# EAGLE design IoT_modules_atmega328_kinemata_v1 (EAGLE 7.2.0)
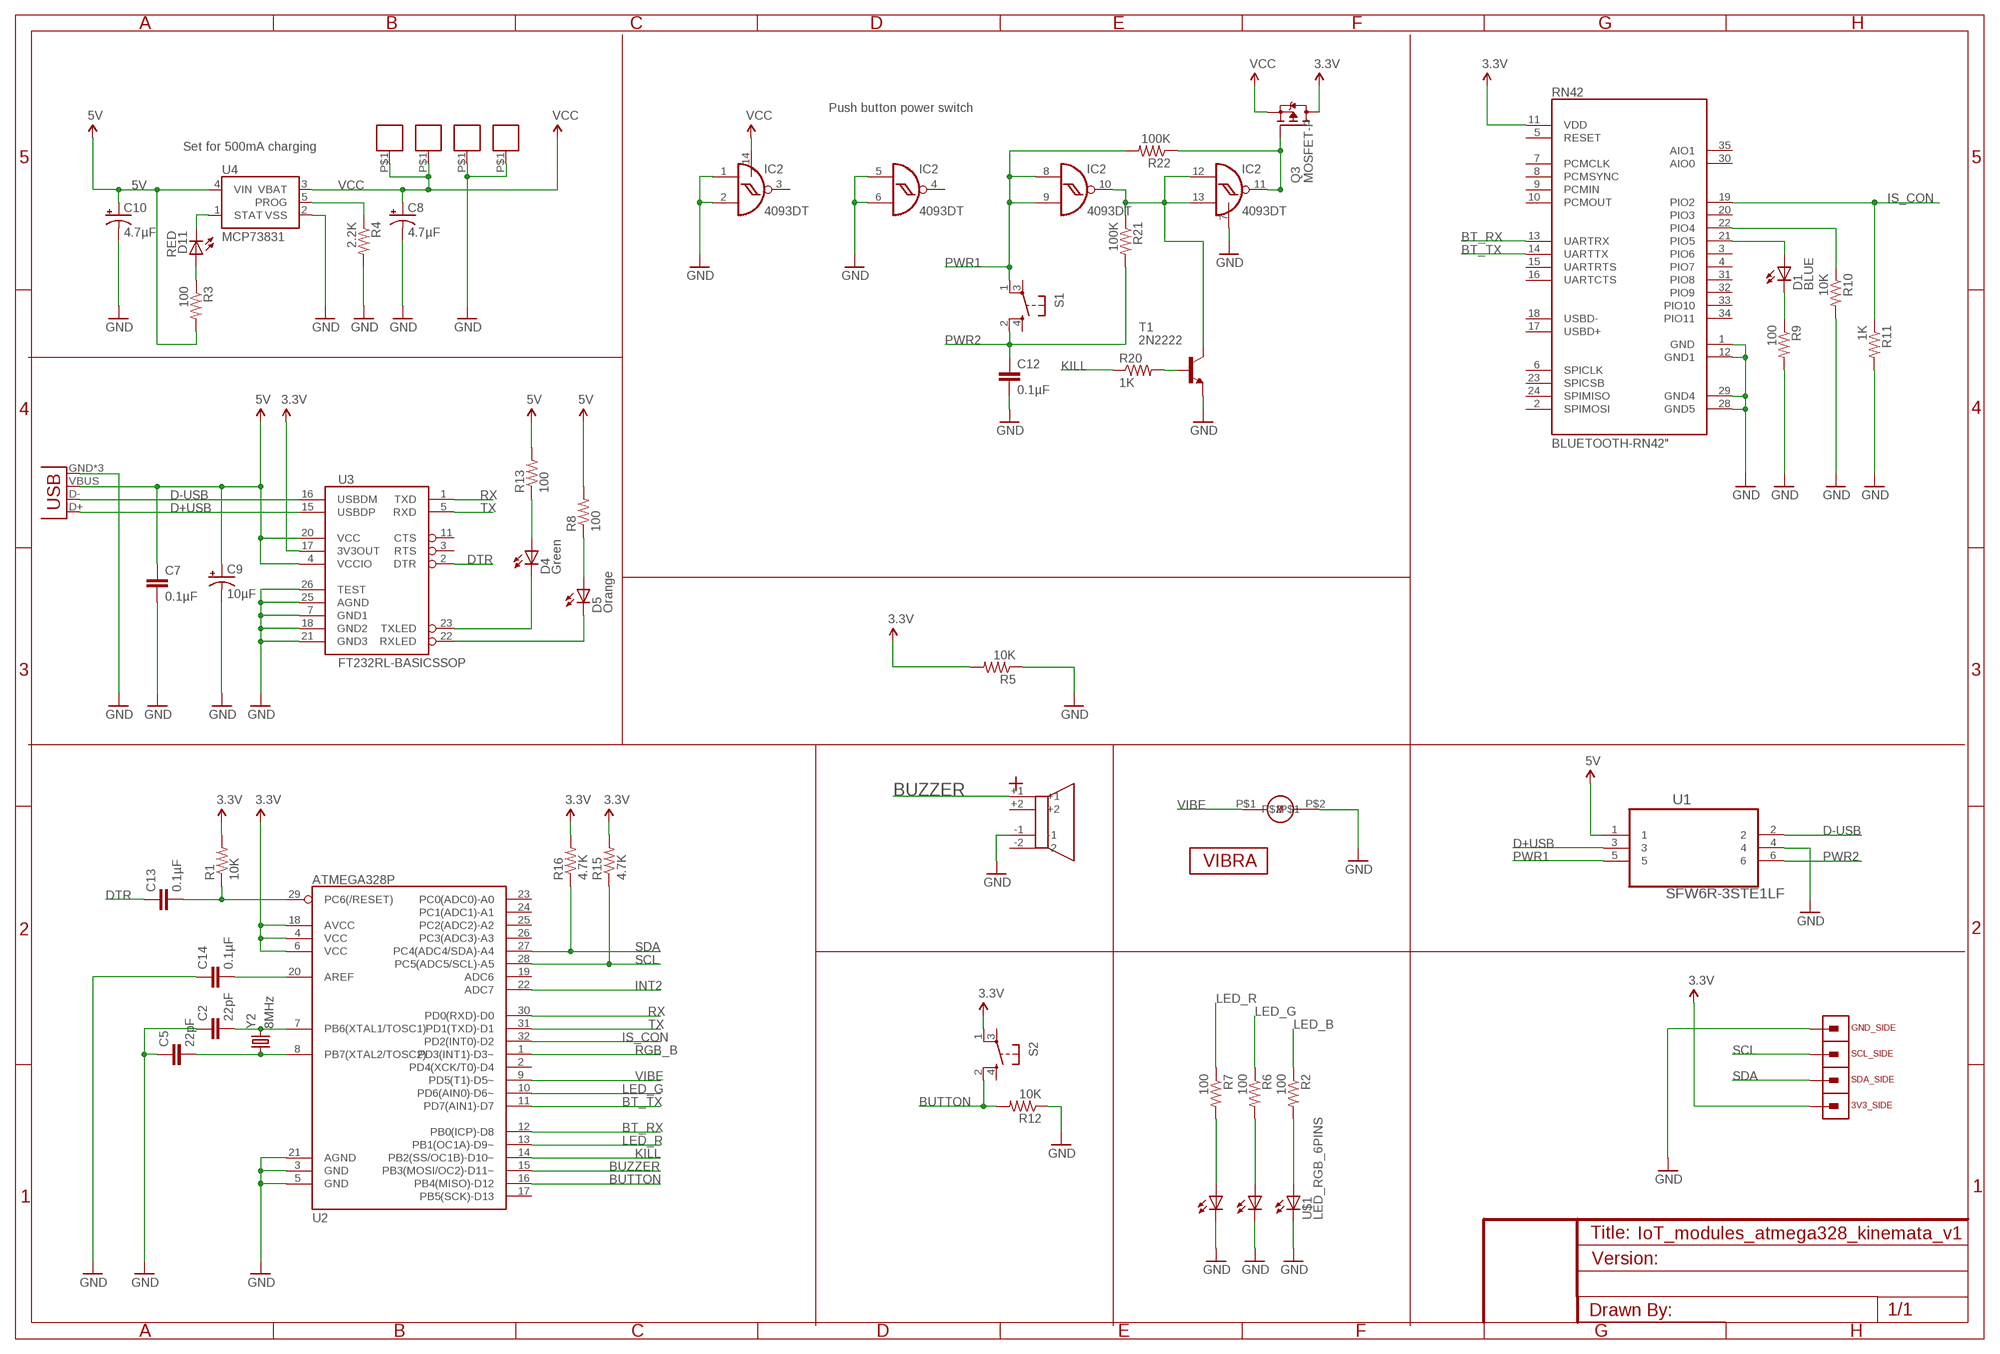
[diagram p0: schematic, sheet 1]

## Parts
3V3_SIDE  HEADER_1PIN_MALE  [SPRING_LOADED_HEADER_ANGLE_829-22-020-20-002101_DIGIKEY_ED1320-ND]
BAT+1  LIPO_PAD  [LIPO_PAD]
BAT+2  LIPO_PAD  [LIPO_PAD]
BAT-1  LIPO_PAD  [LIPO_PAD]
BAT-2  LIPO_PAD  [LIPO_PAD]
C2  22pF  CAP1206  [1206]
C5  22pF  CAP1206  [1206]
C7  0.1µF  CAP1206  [1206]
C8  4.7µF  CAP_POL1206  [EIA3216]
C9  10µF  CAP_POL1206  [EIA3216]
C10  4.7µF  CAP_POL1206  [EIA3216]
C12  0.1µF  CAP1206  [1206]
C13  0.1µF  CAP1206  [1206]
C14  0.1µF  CAP1206  [1206]
D1  BLUE  LED1206  [LED-1206]
D4  Green  LED1206  [LED-1206]
D5  Orange  LED1206  [LED-1206]
D11  RED  LED1206  [LED-1206]
GND_SIDE  HEADER_1PIN_MALE  [SPRING_LOADED_HEADER_ANGLE_829-22-020-20-002101_DIGIKEY_ED1320-ND]
IC2  4093DT  [MC14093B-TSSOP14]
JP6  USB-MICROB  [USB-MICROB]
Q3  MOSFET-P  [SOT23]
R1  10K  RESISTOR1206  [1206]
R2  100  RESISTOR1206  [1206]
R3  100  RESISTOR1206  [1206]
R4  2.2K  RESISTOR1206  [1206]
R5  10K  RESISTOR1206  [1206]
R6  100  RESISTOR1206  [1206]
R7  100  RESISTOR1206  [1206]
R8  100  RESISTOR1206  [1206]
R9  100  RESISTOR1206  [1206]
R10  10K  RESISTOR1206  [1206]
R11  1K  RESISTOR1206  [1206]
R12  10K  RESISTOR1206  [1206]
R13  100  RESISTOR1206  [1206]
R15  4.7K  RESISTOR1206  [1206]
R16  4.7K  RESISTOR1206  [1206]
R20  1K  RESISTOR1206  [1206]
R21  100K  RESISTOR1206  [1206]
R22  100K  RESISTOR1206  [1206]
RN42  BLUETOOTH-RN42"  [RN42]
S1  TAC_SWITCH_SIDEWAY  [TACTILE_SWITCH_ANGLE_SMD]
S2  TAC_SWITCH_SIDEWAY  [TACTILE_SWITCH_ANGLE_SMD]
SCL_SIDE  HEADER_1PIN_MALE  [SPRING_LOADED_HEADER_ANGLE_829-22-020-20-002101_DIGIKEY_ED1320-ND]
SDA_SIDE  HEADER_1PIN_MALE  [SPRING_LOADED_HEADER_ANGLE_829-22-020-20-002101_DIGIKEY_ED1320-ND]
T1  2N2222  [TO92-EBC-OVAL]
U1  SFW6R-3STE1LF  [FCI_SFW6R-3STE1LF]
U2  ATMEGA328P  ATMEGA328_SMT  [TQFP32-08]
U3  FT232RL-BASICSSOP  [SSOP28DB]
U4  MCP73831  [SOT23-5]
U$1  LED_RGB_6PINS  [LED_RGB_6PINS]
U$3  BUZZER_4PINS  [FARNELL_BUZZER_MAGNETIC_SMD_3V_2215091]
U$4  VIBRATION_MOTOR_SHAPE  [VIBRATION_MOTOR_SHAPE]
U$5  VIBRATION_MOTOR  [VIBRATION_MOTOR_CABLE]
Y2  8MHz  CRYSTAL_2PINS5X3.2  [CRYSTAL_8MHZ_SMD_FARNELL_2101329]

## Nets
3.3V: 3V3_SIDE.P$1 Q3.3(D) R1.2 R5.2 R15.2 R16.2 RN42.11(VDD) S2.1(A2) U2.4(VCC) U2.6(VCC) U2.18(AVCC) U3.17(3V3OUT)
5V: C7.1 C9.A(+) C10.A(+) JP6.VBUS R3.2 R8.2 R13.2 U1.1 U3.4(VCCIO) U3.20(VCC) U4.4(VIN)
BT_RX: RN42.13(UARTRX) U2.12(PB0(ICP)-D8)
BT_TX: RN42.14(UARTTX) U2.11(PD7(AIN1)-D7)
BUTTON: R12.2 S2.2(B2) U2.16(PB4(MISO)-D12)
BUZZER: U2.15(PB3(MOSI/OC2)-D11~) U$3.+1
D+USB: JP6.D+ U1.3 U3.15(USBDP)
D-USB: JP6.D- U1.2 U3.16(USBDM)
DTR: C13.1 U3.2(DTR)
GND: BAT-1.P$1 BAT-2.P$1 C2.1 C5.1 C7.2 C8.C(-) C9.C(-) C10.C(-) C12.2 C14.1 GND_SIDE.P$1 IC2.1 IC2.2 IC2.5 IC2.6 IC2.7 JP6.GND JP6.MT1(GND) JP6.MT2(GND) R4.2 R5.1 R9.2 R10.2 R11.2 R12.1 RN42.1(GND) RN42.12(GND1) RN42.28(GND5) RN42.29(GND4) T1.E U1.4 U2.3(GND) U2.5(GND) U2.21(AGND) U3.7(GND1) U3.18(GND2) U3.21(GND3) U3.25(AGND) U3.26(TEST) U4.2(VSS) U$1.BC U$1.GC U$1.RC U$3.-1 U$5.P$2
INT2: U2.22(ADC7)
IS_CON: R11.1 RN42.19(PIO2) U2.32(PD2(INT0)-D2)
KILL: R20.1 U2.14(PB2(SS/OC1B)-D10~)
LED_B: R2.1
LED_G: R6.1 U2.10(PD6(AIN0)-D6~)
LED_R: R7.1 U2.13(PB1(OC1A)-D9~)
N$1: R7.2 U$1.BA
N$2: R2.2 U$1.GA
N$3: D11.A R3.1
N$4: R6.2 U$1.RA
N$7: D4.A R13.1
N$9: D5.A R8.1
N$12: R10.1 RN42.22(PIO4)
N$13: D1.A RN42.21(PIO5)
N$14: C5.2 U2.8(PB7(XTAL2/TOSC2)) Y2.P$1
N$16: C2.2 U2.7(PB6(XTAL1/TOSC1)) Y2.P$2
N$17: D1.C R9.1
N$18: C13.2 R1.1 U2.29(PC6(/RESET))
N$19: C14.2 U2.20(AREF)
N$23: IC2.10 IC2.12 IC2.13 R21.1 T1.C
N$24: R20.2 T1.B
N$27: IC2.11 Q3.1(G) R22.1
PROG: R4.1 U4.5(PROG)
PWR1: IC2.8 IC2.9 R22.2 S1.1(A2) U1.5
PWR2: C12.1 R21.2 S1.2(B2) U1.6
RGB_B: U2.1(PD3(INT1)-D3~)
RX: U2.30(PD0(RXD)-D0) U3.1(TXD)
RXLED: D5.C U3.22(RXLED)
SCL: R15.1 SCL_SIDE.P$1 U2.28(PC5(ADC5/SCL)-A5)
SDA: R16.1 SDA_SIDE.P$1 U2.27(PC4(ADC4/SDA)-A4)
STAT: D11.C U4.1(STAT)
TX: U2.31(PD1(TXD)-D1) U3.5(RXD)
TXLED: D4.C U3.23(TXLED)
VCC: BAT+1.P$1 BAT+2.P$1 C8.A(+) IC2.14 Q3.2(S) U4.3(VBAT)
VIBE: U2.9(PD5(T1)-D5~) U$5.P$1
Unconnected: IC2.3 IC2.4 RN42.2(SPIMOSI) RN42.3(PIO6) RN42.4(PIO7) RN42.5(RESET) RN42.6(SPICLK) RN42.7(PCMCLK) RN42.8(PCMSYNC) RN42.9(PCMIN) RN42.10(PCMOUT) RN42.15(UARTRTS) RN42.16(UARTCTS) RN42.17(USBD+) RN42.18(USBD-) RN42.20(PIO3) RN42.23(SPICSB) RN42.24(SPIMISO) RN42.30(AIO0) RN42.31(PIO8) RN42.32(PIO9) RN42.33(PIO10) RN42.34(PIO11) RN42.35(AIO1) S1.3(A1) S1.4(B1) S2.3(A1) S2.4(B1) U2.2(PD4(XCK/T0)-D4) U2.17(PB5(SCK)-D13) U2.19(ADC6) U2.23(PC0(ADC0)-A0) U2.24(PC1(ADC1)-A1) U2.25(PC2(ADC2)-A2) U2.26(PC3(ADC3)-A3) U3.3(RTS) U3.11(CTS) U$3.+2 U$3.-2

## Notes on the sheet
- Push button power switch
- Set for 500mA charging

## Library data of the parts
3V3_SIDE GND_SIDE SCL_SIDE SDA_SIDE = MlabPaja_v3:HEADER_1PIN_MALE
BAT+1 BAT+2 BAT-1 BAT-2 = MlabPaja_v3:LIPO_PAD
C2 C5 C7 C12-C14 = SparkFun-Passives:CAP: Capacitor Standard 0603 ceramic capacitor, and 0.1" leaded capacitor.
C8-C10 = SparkFun-Passives:CAP_POL: Capacitor Polarized These are standard SMD and PTH capacitors. Normally 10uF, 47uF, and 100uF in electrolytic and tantalum varieties. Always verify the external diameter of the through hole cap, it varies with capacity, voltage, and manufacturer. The EIA devices should be standard.
D1 D4 D5 D11 = SparkFun-LED:LED: LEDs Standard schematic elements and footprints for 5mm, 3mm, 1206, and 0603 sized LEDs. 5mm - Spark Fun Electronics SKU : COM-00529 (and others)
IC2 = MlabPaja_v3:4093: Quad 2-input NAND schmitt trigger
JP6 = SparkFun-Connectors:USB: USB Connectors USB-B-PTH is fully proven SKU : PRT-00139/CONN-08278 USB-miniB is fully proven SKU : PRT-00587 USB-A-PCB is untested. USB-A-H is throughly reviewed, but untested. Spark Fun Electronics SKU : PRT-00437 USB-B-SMT is throughly reviewed, but untested. Needs silkscreen touching up. USB-A-S has not been used/tested USB-MB-H has not been used/tested USB-MICROB has been used. CONN-09505; PROD_ID: CONN-09505
Q3 = MlabPaja_v3:MOSFET-P
R1-R13 R15 R16 R20-R22 = SparkFun-Resistors:RESISTOR: Resistor Basic schematic elements and footprints for 0603, 1206, and PTH resistors.
RN42 = MlabPaja_v3:BLUETOOTH-RN42: Bluetooth SMD module
S1 S2 = MlabPaja_v3:TAC_SWITCH: Momentary Switch Button commonly used for reset or general input. Spark Fun Electronics SKU : COM-00097 SMT- SWCH-08247; PROD_ID: SWCH-08247
T1 = adafruit:2N2222: NPN TRANSISTOR Big oval pads
U1 = MlabPaja_v3:SFW6R-3STE1LF: FFC/FPC CONNECTOR, RECEPTACLE, 6POS 1ROW; MPN: SFW6R-3STE1LF; OC_FARNELL: 1835600; OC_NEWARK: 62K5642; PACKAGE: CONNECTOR-6POS; SUPPLIER: FCI
U2 = MlabPaja_v3:ATMEGA328_SMT: 32-Pin Atmega328 part Commonly used on Arduino compatible boards Available in QFP and QFN packages TQFP is IC-09069 QFN is non-stock; PROD_ID: IC-09069
U3 = SparkFun-DigitalIC:FT232RL-BASIC: USB UART This is the simplified version of the FT232RL unit. Only what you need, nothing you don't. Spark Fun Electronics SKU : COM-00650
U4 = SparkFun:MCP73831: Microchip's MCP73831 Miniature single cell, fully integrated Li-Ion, Li-polymer charge management controller http://ww1.microchip.com/downloads/en/DeviceDoc/21984a.pdf
U$1 = Mlab_ProEx2015:LED_RGB_6PINS
U$3 = MlabPaja_v2:BUZZER_4PINS
U$4 = MlabPaja_v3:VIBRATION_MOTOR_SHAPE
U$5 = MlabPaja_v3:VIBRATION_MOTOR
Y2 = MlabPaja_v2:CRYSTAL_2PINS

## Net classes
0 default: clearance 0.21 mm

## Board
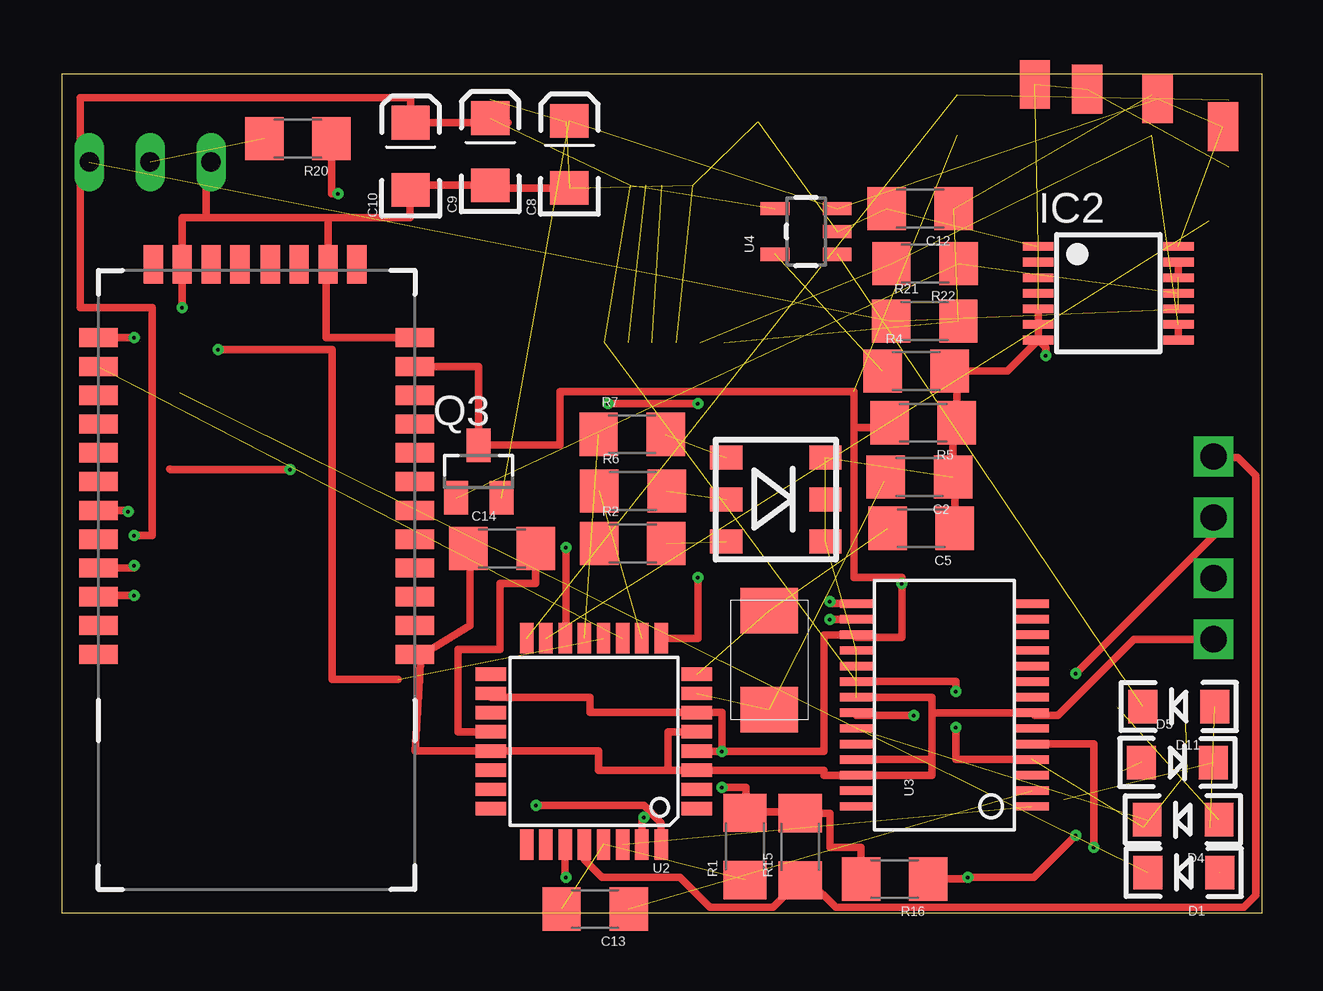
[diagram p1: board, top side]
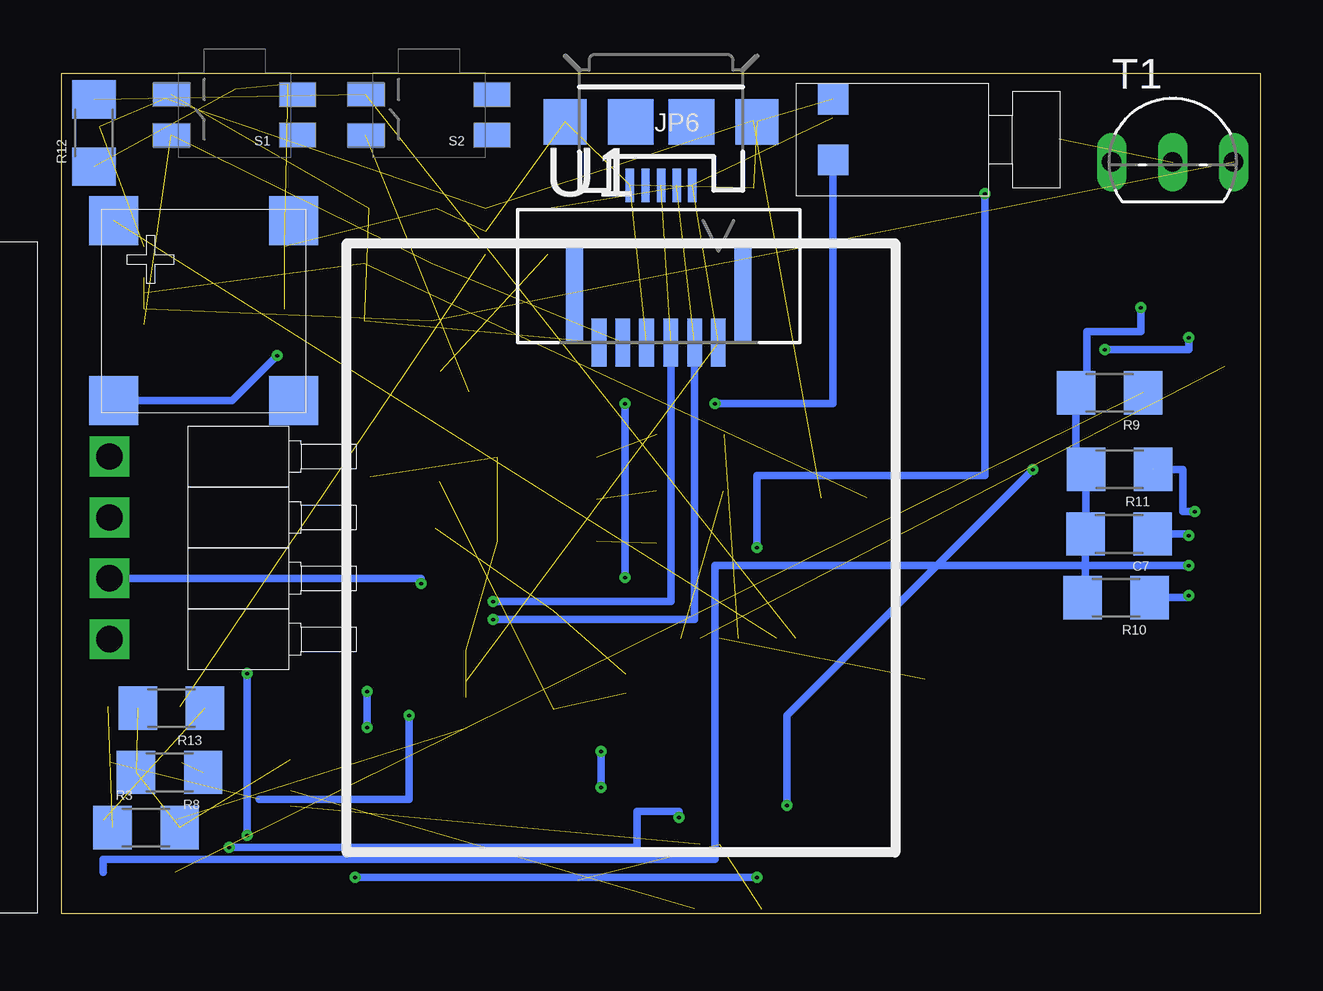
[diagram p2: board, bottom side, seen from below]

Size 50 x 35 mm. Coordinates in mm from the lower left corner, seen from the top.
Outline: 0,0 0,35 50,35 50,0 0,0
Copper layers (1*16): Top 0.035mm / dielectric 0.2mm / Bottom 0.035mm
Design rules "SeeedStudio_DRU_no_angle_20130527_modified": minimum track width 6mil, minimum drill 12mil, track to track 6mil, track to pad 6mil, pad to pad 6mil, via to via 6mil, smd to smd 0mil, copper to edge 10mil, drill to drill 10mil, minimum pad ring 6mil, minimum via ring 6mil, stop-mask expansion 2mil, vias tented up to drill 25mil, thermal gap 10mil

### Footprints (pad centres in the part's own frame; a part is rotated, then mirrored left to right if it is on the bottom)
SPRING_LOADED_HEADER_ANGLE_829-22-020-20-002101_DIGIKEY_ED1320-ND = drill 1.1 square: P$1 0.008,0.004
LIPO_PAD = smd 2.032 x 1.27: P$1 0,0
1206 = smd 1.6 x 1.8: 1 -1.4,0; 2 1.4,0
EIA3216 = smd 1.4 x 1.6: A 1.4,0; C -1.4,0
LED-1206 = smd 1.2 x 1.4: A -1.5,0; C 1.5,0
MC14093B-TSSOP14 = smd 0.36 x 1.26: 1 -1.95,-2.925; 2 -1.3,-2.925; 3 -0.65,-2.925; 4 0,-2.925; 5 0.65,-2.925; 6 1.3,-2.925; 7 1.95,-2.925; 8 1.95,2.925; 9 1.3,2.925; 10 0.65,2.925; 11 0,2.925; 12 -0.65,2.925; 13 -1.3,2.925; 14 -1.95,2.925
USB-MICROB = smd 0.35 x 1.4: D+ 0,2.65; D- -0.65,2.65; GND 1.3,2.65; ID 0.65,2.65; VBUS -1.3,2.65 | smd 1.8 x 1.9: MT1 -4,0; MT2 4,0 | smd 1.9 x 1.9: P$1 -1.27,0; P$2 1.27,0
SOT23 = smd 1 x 1.4: 1 -0.95,-1.1; 2 0.95,-1.1; 3 0,1.1
RN42 = smd 0.8 x 1.6: 1 -6.6,-6.6; 2 -5.4,-6.6; 3 -4.2,-6.6; 4 -3,-6.6; 5 -1.8,-6.6; 6 -0.6,-6.6; 7 0.6,-6.6; 8 1.8,-6.6; 9 3,-6.6; 10 4.2,-6.6; 11 5.4,-6.6; 12 6.6,-6.6; 13 6.6,6.6; 14 5.4,6.6; 15 4.2,6.6; 16 3,6.6; 17 1.8,6.6; 18 0.6,6.6; 19 -0.6,6.6; 20 -1.8,6.6; 21 -3,6.6; 22 -4.2,6.6; 23 -5.4,6.6; 24 -6.6,6.6 | smd 1.6 x 0.8: 28 9.65,3.1; 29 9.65,-2.973; 30 9.65,4.3; 31 9.65,1.9; 32 9.65,0.7; 33 9.65,-0.573; 34 9.65,-1.773; 35 9.65,-4.173
TACTILE_SWITCH_ANGLE_SMD = smd 1.524 x 1.016: 1 2.642,1.067; 2 2.642,-0.635; 3 -2.642,1.041; 4 -2.642,-0.635
TO92-EBC-OVAL = drill 0.813 long: B 0,-1.27; C 2.54,-1.27; E -2.54,-1.27
FCI_SFW6R-3STE1LF = smd 0.61 x 2.007: 1 2.489,-2.337; 2 1.499,-2.337; 3 0.508,-2.337; 4 -0.508,-2.337; 5 -1.499,-2.337; 6 -2.489,-2.337 | smd 0.711 x 4.191: 7 -3.505,-0.203; 8 3.505,-0.203
TQFP32-08 = smd 1.27 x 0.559: 1 -4.293,2.8; 2 -4.293,2; 3 -4.293,1.2; 4 -4.293,0.4; 5 -4.293,-0.4; 6 -4.293,-1.2; 7 -4.293,-2; 8 -4.293,-2.8; 17 4.293,-2.8; 18 4.293,-2; 19 4.293,-1.2; 20 4.293,-0.4; 21 4.293,0.4; 22 4.293,1.2; 23 4.293,2; 24 4.293,2.8 | smd 0.559 x 1.27: 9 -2.8,-4.293; 10 -2,-4.293; 11 -1.2,-4.293; 12 -0.4,-4.293; 13 0.4,-4.293; 14 1.2,-4.293; 15 2,-4.293; 16 2.8,-4.293; 25 2.8,4.293; 26 2,4.293; 27 1.2,4.293; 28 0.4,4.293; 29 -0.4,4.293; 30 -1.2,4.293; 31 -2,4.293; 32 -2.8,4.293
SSOP28DB = smd 0.348 x 1.397: 1 -4.225,-3.656; 2 -3.575,-3.656; 3 -2.925,-3.656; 4 -2.275,-3.656; 5 -1.625,-3.656; 6 -0.975,-3.656; 7 -0.325,-3.656; 8 0.325,-3.656; 9 0.975,-3.656; 10 1.625,-3.656; 11 2.275,-3.656; 12 2.925,-3.656; 13 3.575,-3.656; 14 4.225,-3.656; 15 4.225,3.656; 16 3.575,3.656; 17 2.925,3.656; 18 2.275,3.656; 19 1.625,3.656; 20 0.975,3.656; 21 0.325,3.656; 22 -0.325,3.656; 23 -0.975,3.656; 24 -1.625,3.656; 25 -2.275,3.656; 26 -2.925,3.656; 27 -3.575,3.656; 28 -4.225,3.656
SOT23-5 = smd 0.55 x 1.2: 1 -0.95,-1.3; 2 0,-1.3; 3 0.95,-1.3; 4 0.95,1.3; 5 -0.95,1.3
LED_RGB_6PINS = smd 1 x 1.35: BA -1.749,-2.07; BC -1.749,2.07; GA 1.751,-2.07; GC 1.751,2.07; RA 0.001,-2.07; RC 0.001,2.07
FARNELL_BUZZER_MAGNETIC_SMD_3V_2215091 = smd 2.032 x 2.032: +1 -3.607,3.861; +2 3.893,3.861; -1 -3.607,-3.639; -2 3.893,-3.639
VIBRATION_MOTOR_CABLE = smd 1.27 x 1.27: P$1 -1.27,0; P$2 1.27,0
CRYSTAL_8MHZ_SMD_FARNELL_2101329 = smd 1.9 x 2.4: P$1 -2.184,0.076; P$2 1.93,0.076

### Placement (x,y rotation side)
3V3_SIDE  47.99,13.97 180 bottom
BAT+1  48.39,32.8 90 top
BAT+2  45.67,33.96 270 top
BAT-1  40.55,34.56 90 top
BAT-2  42.73,34.35 90 top
C2  35.74,18.19 180 top
C5  35.81,16.05 180 top
C7  5.91,15.82 180 bottom
C8  21.15,31.64 90 top
C9  17.85,31.75 90 top
C10  14.53,31.56 90 top
C12  35.76,29.38 180 top
C13  22.22,0.18 180 top
C14  18.34,15.22 0 top
D1  46.76,1.71 180 top
D4  46.72,3.91 180 top
D5  46.48,6.29 0 top
D11  46.55,8.62 180 top
GND_SIDE  47.99,11.43 180 bottom
IC2  43.61,25.85 270 top
JP6  25,33 180 bottom
Q3  17.36,18.42 0 top
R1  28.46,2.79 90 top
R2  23.78,15.42 0 top
R3  46.47,3.58 0 bottom
R4  35.6,22.61 0 top
R5  35.89,20.46 180 top
R6  23.8,17.61 0 top
R7  23.76,19.97 0 top
R8  45.48,5.88 180 bottom
R9  6.31,21.71 180 bottom
R10  6.04,13.17 180 bottom
R11  5.89,18.52 180 bottom
R12  48.64,32.53 90 bottom
R13  45.41,8.56 180 bottom
R15  30.77,2.78 90 top
R16  34.71,1.43 180 top
R20  9.83,32.3 180 top
R21  35.96,24.69 0 top
R22  35.97,27.09 180 top
RN42  8.11,17.4 90 top
S1  42.77,33.5 180 bottom
S2  34.67,33.5 180 bottom
SCL_SIDE  47.99,19.05 180 bottom
SDA_SIDE  47.99,16.51 180 bottom
T1  3.67,32.59 0 bottom
U1  25.1,26.13 0 bottom
U2  22.17,7.17 180 top
U3  36.78,8.69 90 top
U4  31.01,28.43 90 top
U$1  29.75,17.25 270 top
U$3  44.21,25.02 0 bottom
U$4  14.67,32.38 180 bottom
U$5  17.83,32.67 90 bottom
Y2  29.4,10.43 270 top

### Tracks (layer width: path | path; a pad name or v marks a point on that pad's centre or on a via)
3.3V  (via drill 0.15)  (1 unrouted)
  Top 0.305: U2.18 17.88,9 22,9 22,8.37 U2.6 27.5,8.37 v27.5,6.75 | v27.5,6.75 31.75,6.75 31.75,11.61 U3.17 33.12,11.5 35,11.5 v35,13.75 35,14 33,14 33,20.25 | v27.5,6.75 26.46,6.75 U2.4 | v27.5,5.25 28.5,5.25 28.5,4.23 | 28.5,4.23 R1.2 | 28.5,4.23 30.71,4.23 R15.2 32,4.18 32,2.75 33.31,2.75 R16.2 | RN42.11 17.36,22.8 Q3.3 20.75,19.52 20.75,21.75 33,21.75 33,20.25 | 33,20.25 34.49,20.25 R5.2
  Bottom 0.305: v27.5,6.75 v27.5,5.25 | 3V3_SIDE.P$1 35,13.97 v35,13.75
5V  (via drill 0.15)  (7 unrouted)
  Top 0.305: v3,15.75 3.75,15.75 3.75,25.25 0.75,25.25 0.75,34 14.53,34 C10.A 18.6,32.96 C9.A | U3.20 37.25,9.66 v37.25,9.25 | v37.25,7.75 37.25,6.41 U3.4
  Bottom 0.305: C7.1 3,15.82 v3,15.75 | v37.25,9.25 v37.25,7.75
BT_RX  (via drill 0.15)  (1 unrouted)
  Top 0.305: RN42.13 v3,24 | v6.5,23.5 11.25,23.5 11.25,9.75 14,9.75
  Bottom 0.305: v3,24 3,23.5 v6.5,23.5
BT_TX  (1 unrouted)
BUTTON  (2 unrouted)
BUZZER  (1 unrouted)
D+USB  (via drill 0.15)  (1 unrouted)
  Top 0.305: U3.15 32,12.91 v32,13
  Bottom 0.305: v32,13 24.59,13 U1.3
D-USB  (via drill 0.15)  (1 unrouted)
  Top 0.305: U3.16 32,12.26 v32,12.25
  Bottom 0.305: v32,12.25 23.6,12.25 U1.2
DTR  (1 unrouted)
GND  (via drill 0.15)  (18 unrouted)
  Top 0.305: 25.25,5.97 22.35,5.97 22.35,6.77 U2.21 14.71,6.77 14.96,10.75 | 25.25,5.97 U2.3 31.75,5.97 31.75,5.75 U3.26 | 6,29 5.01,29 RN42.28 5.01,25.25 v5,25.25 | 6,29 6,31.32 T1.E | 6,29 11.09,29 | 11.09,29 RN42.29 11,27.05 11,24 RN42.12 | IC2.5 IC2.6 IC2.7 | C14.1 17,14.72 17,12 14.96,10.75 | 14.96,10.75 RN42.1 | 36.25,8.36 36.25,9 U3.21 | 36.25,8.36 U3.7 40.55,8.25 41.5,8.25 44.68,11.43 GND_SIDE.P$1 | 36.25,8.36 36.25,6.41 | 36.25,6.41 36.25,5.75 U3.26 | U3.25 36.25,6.41 | U3.26 | U2.5 25.25,7.57 25.25,5.97 | C5.1 37.21,18.12 C2.1 37.14,20.3 R5.1 37.29,22.32 R4.2 39.4,22.61 IC2.7 | v41,23.25 41,23.59 IC2.7 | 11.09,29 14.5,29 14.5,30.16 C10.C 14.53,30.35 C9.C 17.85,30.24 C8.C
  Bottom 0.305: R10.2 7.31,13.16 C7.2 7.29,15.82 R11.2 7.71,18.52 R9.2 7.25,21.71 7.25,24.25 5,24.25 v5,25.25 | U$3.-1 42.87,21.38 v41,23.25
IS_CON  (via drill 0.15)  (1 unrouted)
  Top 0.305: RN42.19 2.75,16.8 v2.75,16.75 | U2.32 24.97,3.78 24.25,4.5 v19.75,4.5 | v9.5,18.5 4.51,18.5 R11.1
  Bottom 0.305: v2.75,16.75 3.25,16.75 3.25,18.5 4.49,18.5 R11.1 | v19.75,4.5 19.75,8.25 v9.5,18.5
KILL  (via drill 0.15)
  Top 0.305: R20.1 11.23,30 v11.5,30 | v21,15.25 21,11.46 U2.14
  Bottom 0.305: v11.5,30 11.5,18.25 21,18.25 v21,15.25
LED_G  (1 unrouted)
LED_R  (1 unrouted)
N$1  (1 unrouted)
N$2  (1 unrouted)
N$3  (1 unrouted)
N$4  (1 unrouted)
N$7  (1 unrouted)
N$9  (1 unrouted)
N$12  (via drill 0.15)
  Top 0.305: v3,13.25 1.51,13.25 RN42.22
  Bottom 0.305: R10.1 3,13.16 v3,13.25
N$13  (via drill 0.15)  (1 unrouted)
  Top 0.305: RN42.21 3,14.4 v3,14.5
  Bottom 0.305: v3,14.5 22.75,14.5 22.75,2.25 48.26,2.25 D1.A
N$14  (2 unrouted)
N$16  (2 unrouted)
  Top 0.305: C2.2 34.25,18.19 34.25,18
N$17  (1 unrouted)
N$18  (2 unrouted)
N$19
  Top 0.305: U2.20 16.5,7.57 16.5,11 18.25,11 18.25,13.75 19.74,13.75 C14.2
N$23  (3 unrouted)
  Top 0.305: IC2.12 IC2.13
N$24  (1 unrouted)
N$27  (2 unrouted)
PROG  (1 unrouted)
PWR1  (3 unrouted)
  Top 0.305: IC2.9 IC2.8
PWR2  (3 unrouted)
RX  (1 unrouted)
RXLED  (via drill 0.15)  (1 unrouted)
  Top 0.305: U3.22 33.12,8.25 v35.5,8.25
  Bottom 0.305: v35.5,8.25 35.5,4.75 41.75,4.75
SCL
  Top 0.305: U2.28 21.77,2.23 22.5,1.5 25.75,1.5 27,0.25 29.64,0.25 R15.1 31.12,1.38 32.25,0.25 49.25,0.25 49.75,0.75 49.75,18.25 49,19 48.04,19 SCL_SIDE.P$1
SDA  (via drill 0.15)
  Top 0.305: R16.1 37.75,1.43 v37.75,1.5 40.5,1.5 v42.25,3.25 | v21,1.5 20.97,1.5 U2.27 | SDA_SIDE.P$1 48,15.75 v42.25,10
  Bottom 0.305: v37.75,1.5 v21,1.5 | v42.25,10 v42.25,3.25
STAT  (1 unrouted)
TX  (via drill 0.15)
  Top 0.305: U3.5 43,7.06 v43,2.75 | v24.25,4 24.17,4 U2.31
  Bottom 0.305: v43,2.75 26,2.75 26,4.25 24.25,4.25 v24.25,4
TXLED  (1 unrouted)
VCC  (5 unrouted)
VIBE  (via drill 0.15)
  Top 0.305: v22.75,21.25 v26.5,21.25 | v26.5,14 26.5,11.46 U2.9
  Bottom 0.305: U$5.P$1 17.83,21.25 v22.75,21.25 | v26.5,21.25 v26.5,14